# EAGLE design box (EAGLE 8.0.2)
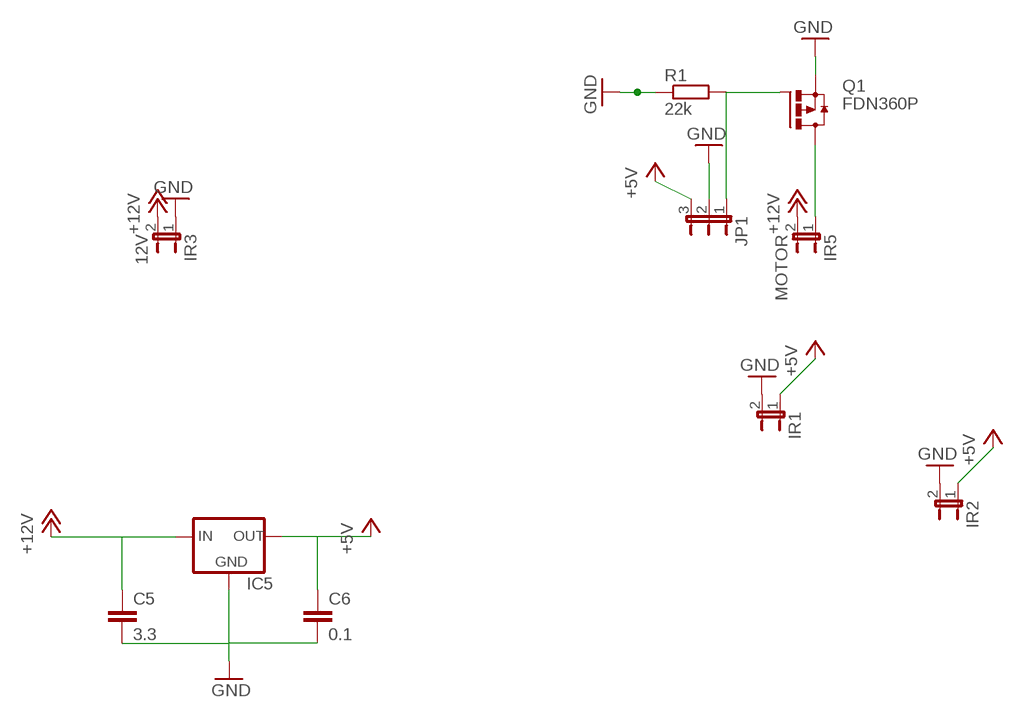
[diagram p0: schematic, sheet 1]

## Parts
C5  3.3  C-EU025-024X044  [C025-024X044]
C6  0.1  C-EU025-024X044  [C025-024X044]
IC5  78XXL  [78XXL]
IR1  JP1E  [JP1]
IR2  JP1E  [JP1]
IR3  12V  JP1E  [JP1]
IR5  MOTOR  JP1E  [JP1]
JP1  JP2E  [JP2]
Q1  FDN360P  [SUPER-SOT3]
R1  22k  R-EU_0204/7  [0204/7]

## Nets
+5V: C6.1 IC5.OUT IR1.1 IR2.1 JP1.3
+12V: C5.1 IC5.IN IR3.2 IR5.2
GND: C5.2 C6.2 IC5.GND IR1.2 IR2.2 IR3.1 JP1.2 Q1.2(S) R1.1
N$1: IR5.1 Q1.3(D)
N$2: JP1.1 Q1.1(G) R1.2

## Library data of the parts
C5 C6 = rcl:C-EU: CAPACITOR, European symbol
IC5 = v-reg:78XXL: VOLTAGE REGULATOR
IR1-IR3 IR5 = jumper:JP1E: JUMPER
JP1 = jumper:JP2E: JUMPER
Q1 = transistor-power:FDN360P: Single P-Channel, PowerTrench (R) MOSFET Source: http://www.fairchildsemi.com/ds/FD/FDN360P.pdf
R1 = rcl:R-EU_: RESISTOR, European symbol

## Net classes
0 default: clearance 0.205 mm

## Board
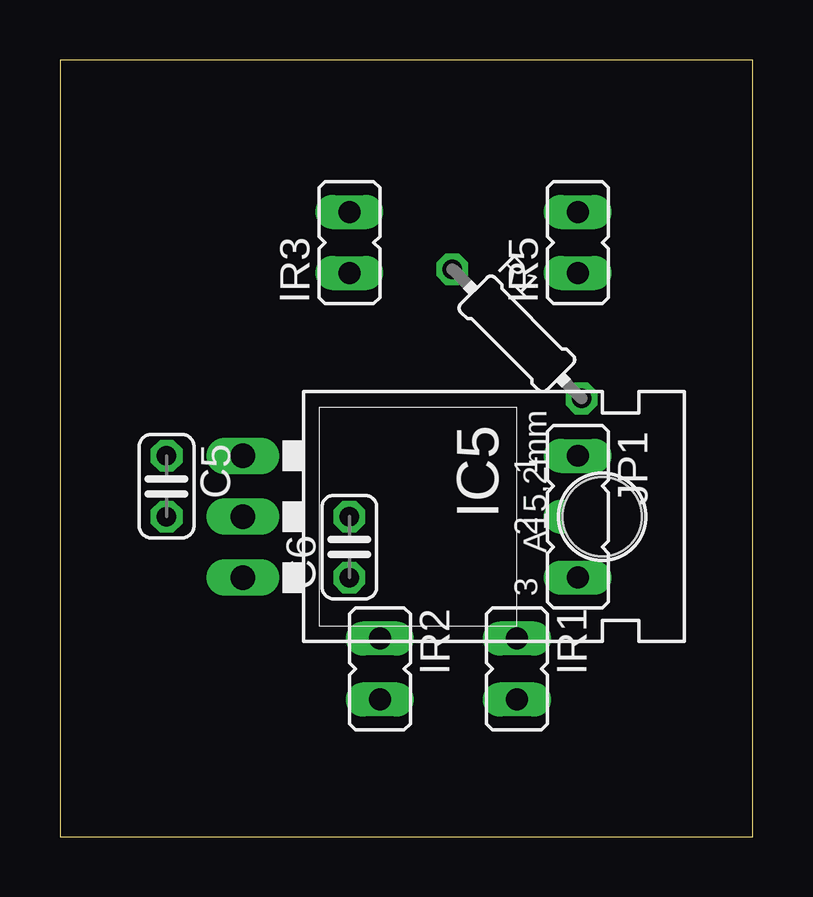
[diagram p1: board, top side]
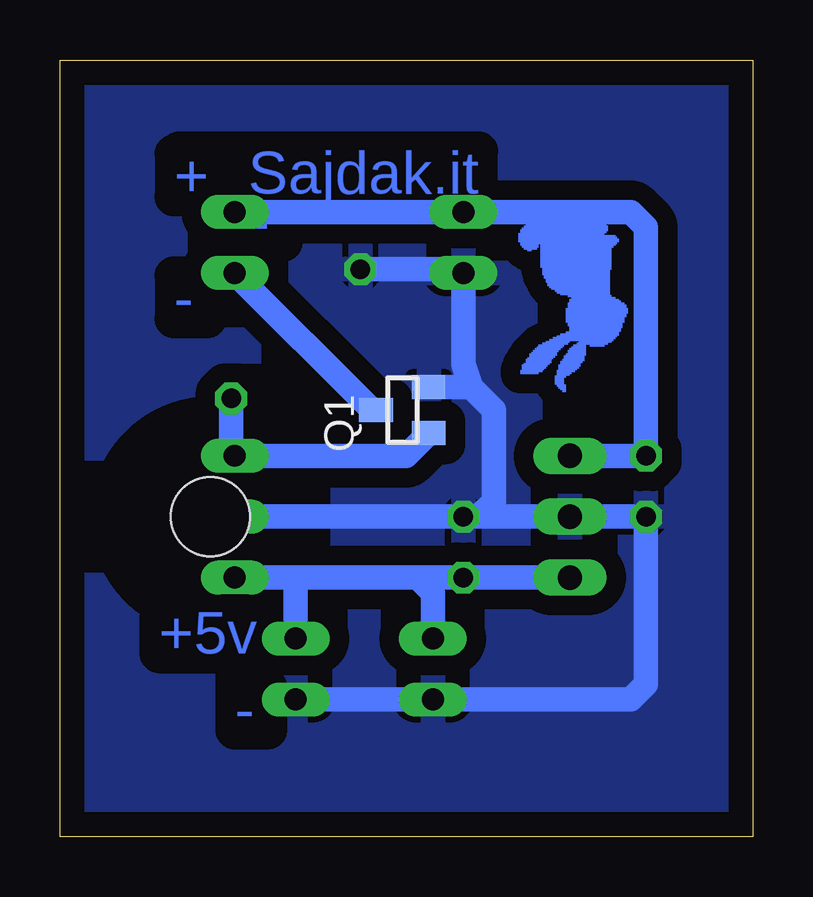
[diagram p2: board, bottom side, seen from below]

Size 28.88 x 32.38 mm. Coordinates in mm from the lower left corner, seen from the top.
Outline: 0,0 28.88,0 28.88,32.38 0,32.38 0,0
Copper layers (1*16): Top 0.035mm / dielectric 1.5mm / Bottom 0.035mm
Design rules "default": minimum track width 10mil, minimum drill 24mil, track to track 8mil, track to pad 8mil, pad to pad 8mil, via to via 8mil, smd to smd 8mil, copper to edge 40mil, drill to drill 8mil, minimum pad ring 10mil, minimum via ring 8mil, stop-mask expansion 4mil, vias tented up to drill 0mil, thermal gap 10mil

### Footprints (pad centres in the part's own frame; a part is rotated, then mirrored left to right if it is on the bottom)
C025-024X044 = drill 0.813 octagon: 1 -1.27,0; 2 1.27,0
78XXL = drill 1.016 long: GND 0,-3.81; IN -2.54,-3.81; OUT 2.54,-3.81 | hole 3.302: 0,11.176
JP1 = drill 0.914 long: 1 0,-1.27; 2 0,1.27
JP2 = drill 0.914 long: 1 -2.54,0; 2 0,0; 3 2.54,0
SUPER-SOT3 = smd 1 x 1.4: 1 -0.95,-1.1; 2 0.95,-1.1; 3 0,1.1
0204/7 = drill 0.813 octagon: 1 -3.81,0; 2 3.81,0

### Placement (x,y rotation side)
C5  4.45,14.6 270 top
C6  12.06,12.06 90 top
IC5  11.43,13.33 270 top
IR1  19.05,6.99 180 top
IR2  13.34,6.99 180 top
IR3  12.06,24.77 0 top
IR5  21.59,24.77 0 top
JP1  21.59,13.33 270 top
Q1  14.6,17.78 90 bottom
R1  19.05,20.96 315 top

### Tracks (layer width: path | path; a pad name or v marks a point on that pad's centre or on a via)
+5V
  Bottom 1.016: IC5.OUT C6.1 13.97,10.79 | 19.05,10.79 13.97,10.79 | 19.05,10.79 JP1.3 | IR2.1 13.34,10.16 13.97,10.79 | IR1.1 19.05,10.79
+12V
  Bottom 1.016: IR5.2 IR3.2 5.08,26.04 4.45,25.4 C5.1 IC5.IN
GND
  Bottom 1.016: JP1.2 C6.2 | 11.74,18.73 Q1.2 | C6.2 11.43,13.33 10.79,13.97 10.79,17.78 11.74,18.73 | C6.2 IC5.GND C5.2 4.45,6.35 5.08,5.71 IR2.2 IR1.2 | 11.74,18.73 12.06,19.68 IR3.1 11.58,23.65 R1.1
  pour Bottom (isolate 0.813): 1.27,31.12 36.83,31.12 36.83,-0.64 1.27,-0.64
N$1
  Bottom 1.016: Q1.3 15.87,17.78 IR5.1
N$2
  Bottom 1.016: Q1.1 14.46,15.88 JP1.1 21.74,16.03 R1.2
(copper drawn outside any net)
  shapes: Bottom area x115

### Text on the board
Bottom: Sajdak.it | + | - | - | - | - | +5v | -